# EAGLE board SCIENTECH_2201 (EAGLE 9.6.1), part 1 of 2
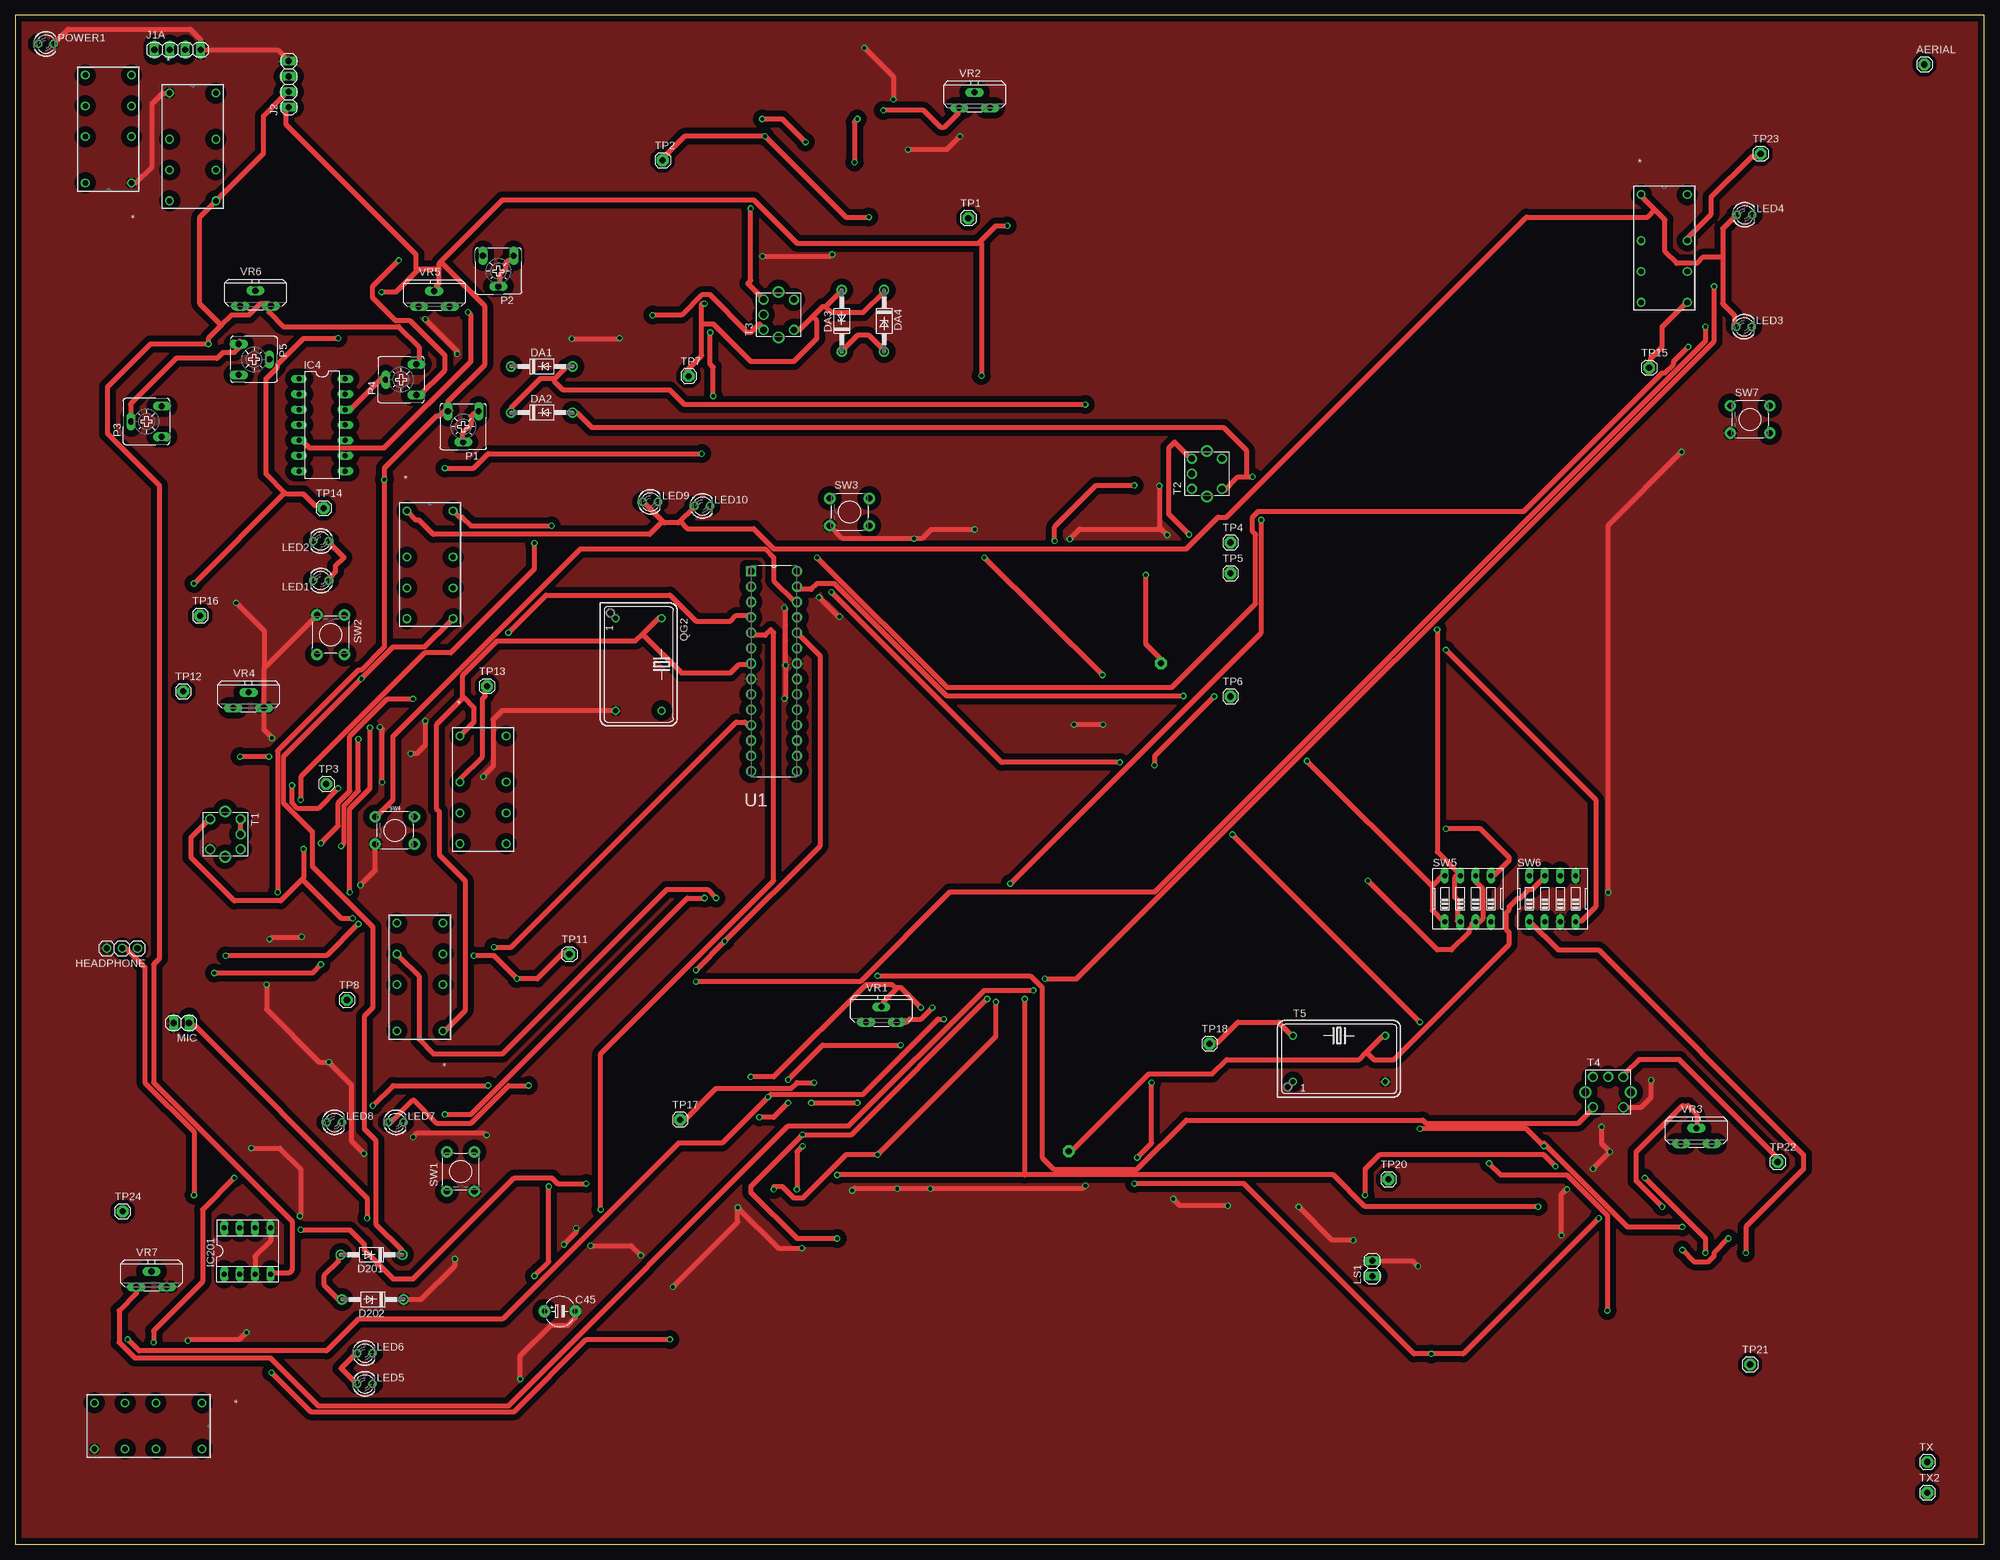
[diagram p2: board, top side]
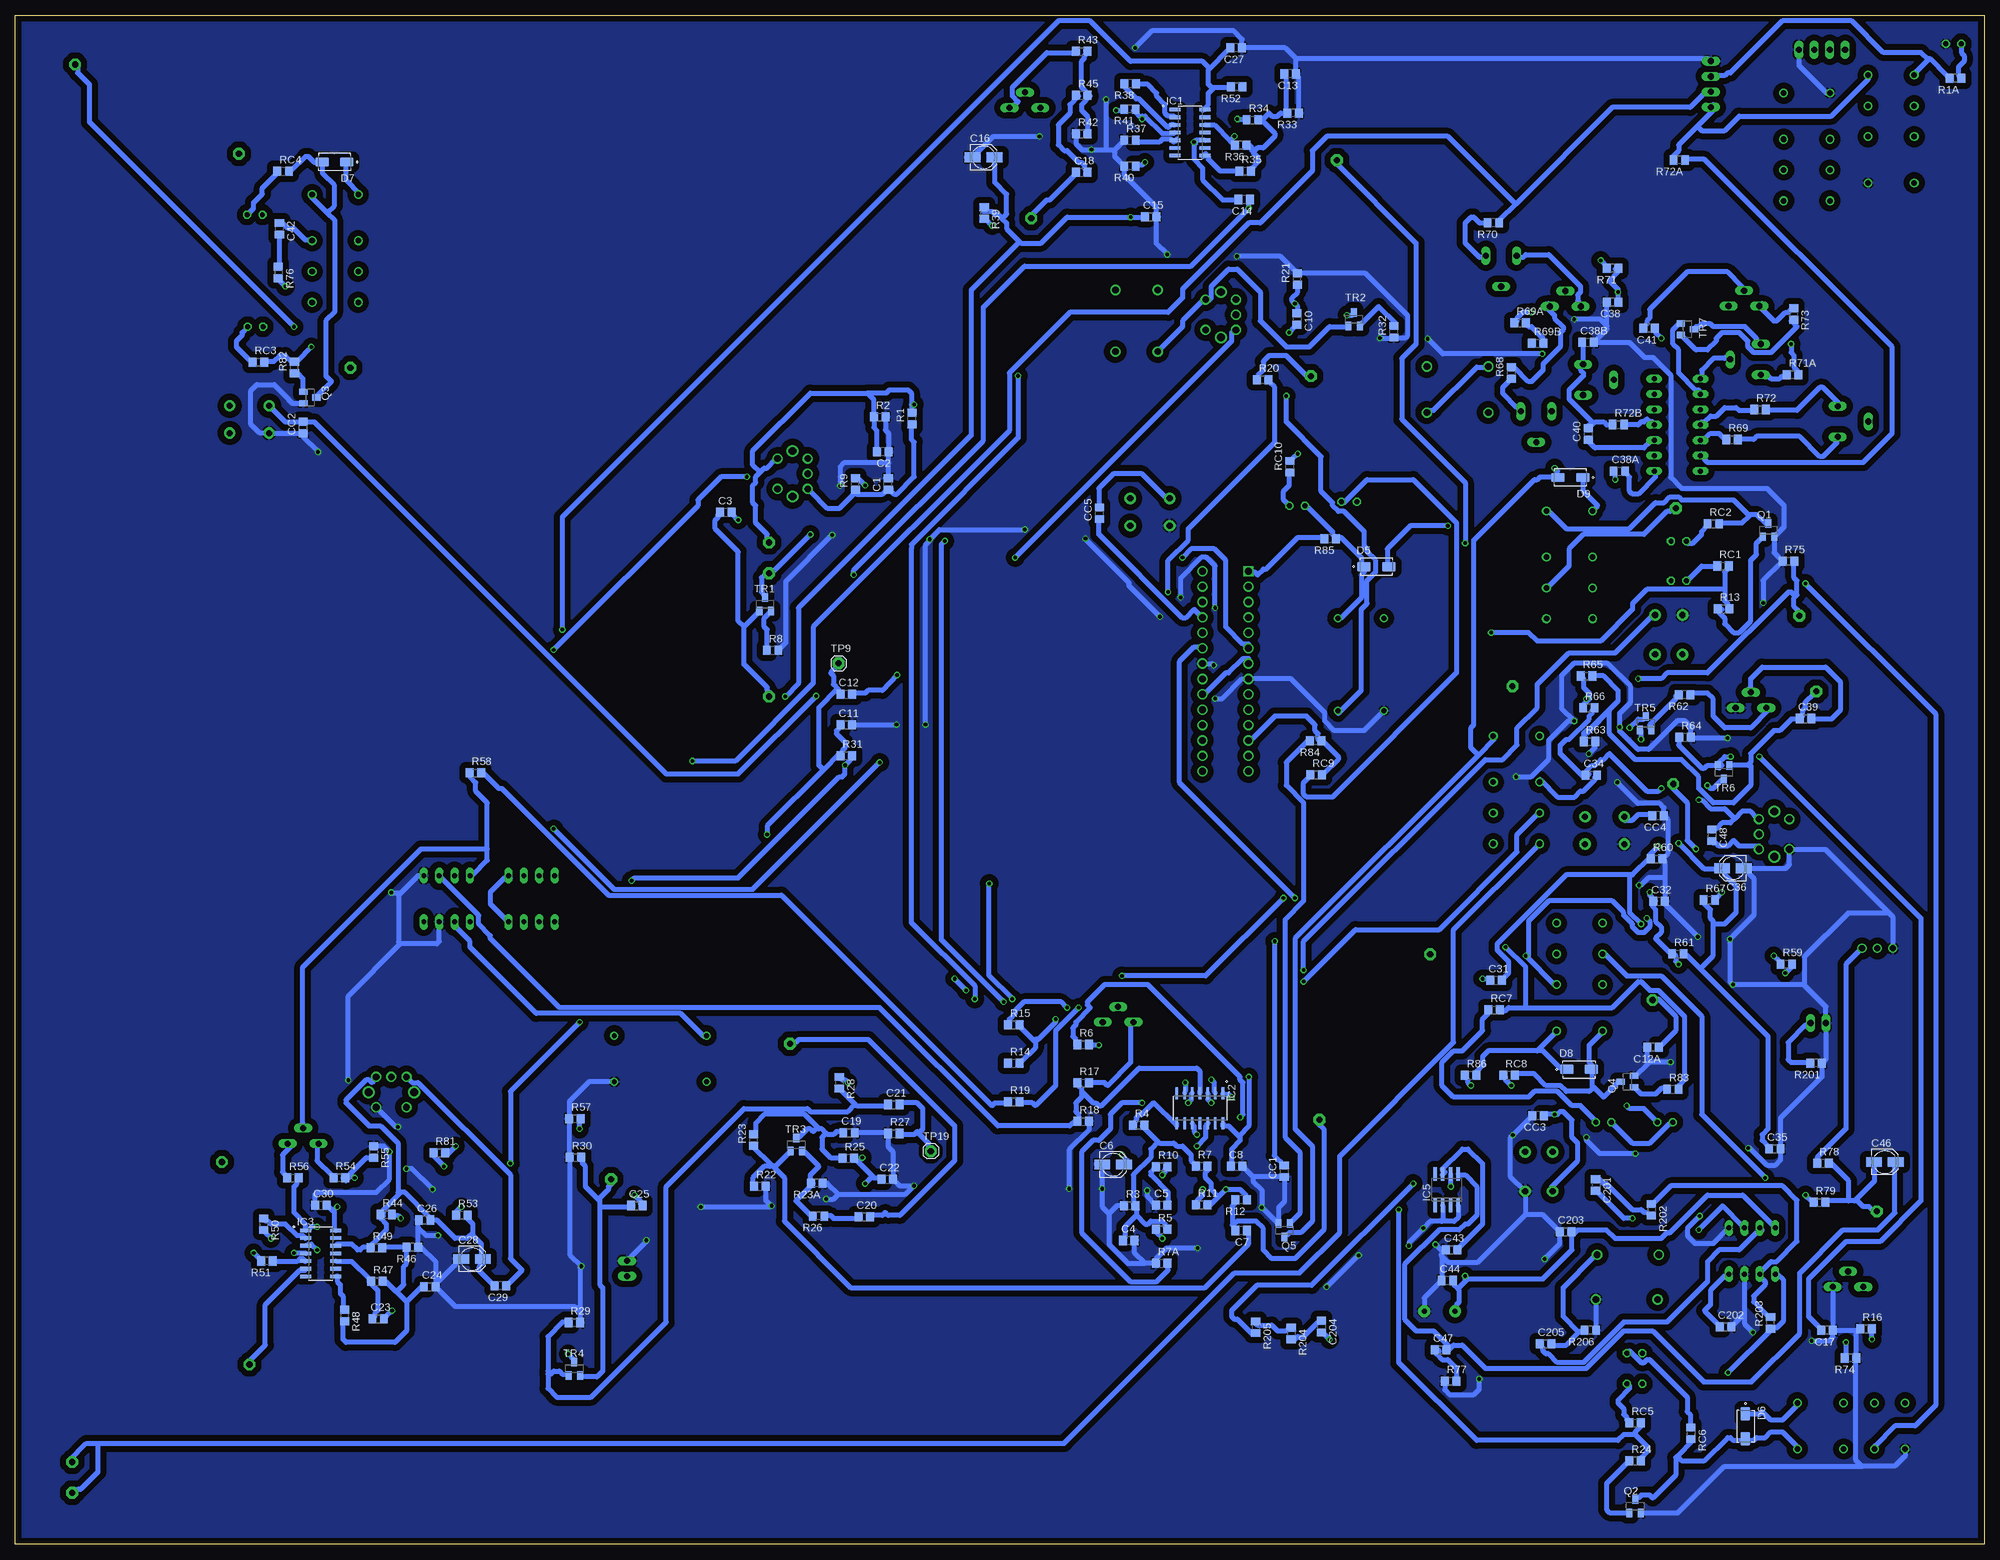
[diagram p3: board, bottom side, seen from below]

Size 325.1 x 252.4 mm. Coordinates in mm from the lower left corner, seen from the top.
Outline: 0,0 325.1,0 325.1,252.4 0,252.4 0,0
Copper layers (1*16): Top 0.035mm / dielectric 1.5mm / Bottom 0.035mm
Design rules "default *": minimum track width 0.8mm, minimum drill 0.6mm, track to track 6mil, track to pad 6mil, pad to pad 6mil, via to via 6mil, smd to smd 6mil, copper to edge 4mil, drill to drill 6mil, minimum pad ring 10mil, minimum via ring 8mil, stop-mask expansion 4mil, vias tented up to drill 0mil, thermal gap 10mil

## Footprints (pad centres in the part's own frame; a part is rotated, then mirrored left to right if it is on the bottom)
1X01 = drill 1.016 pad 1.93 octagon: 1 0,0
C0805 = smd 1.3 x 1.5: 1 -0.95,0; 2 0.95,0
153CLV-0405 = smd 2.6 x 1.6: + 1.8,0; - -1.8,0
E5-5 = drill 0.813 pad 1.905: + -2.54,0 | drill 0.813 pad 1.905 octagon: - 2.54,0
DIOM505270X240 = smd 2.21 x 1.53: A 2.05,0; C -2.05,0
DO41Z10 = drill 1.118: A 5.08,0; C -5.08,0
1X03 = drill 1.016: 1 -2.54,0; 2 0,0; 3 2.54,0
SOIC127P600X175-14N = smd 1.95 x 0.59: 1 -2.48,3.81; 2 -2.48,2.54; 3 -2.48,1.27; 4 -2.48,0; 5 -2.48,-1.27; 6 -2.48,-2.54; 7 -2.48,-3.81; 8 2.48,-3.81; 9 2.48,-2.54; 10 2.48,-1.27; 11 2.48,0; 12 2.48,1.27; 13 2.48,2.54; 14 2.48,3.81
DIL14 = drill 0.813 long: 1 -7.62,-3.81; 2 -5.08,-3.81; 3 -2.54,-3.81; 4 0,-3.81; 5 2.54,-3.81; 6 5.08,-3.81; 7 7.62,-3.81; 8 7.62,3.81; 9 5.08,3.81; 10 2.54,3.81; 11 0,3.81; 12 -2.54,3.81; 13 -5.08,3.81; 14 -7.62,3.81
SO08 = smd 0.6 x 2.2: 1 -1.905,-2.6; 2 -0.635,-2.6; 3 0.635,-2.6; 4 1.905,-2.6; 5 1.905,2.6; 6 0.635,2.6; 7 -0.635,2.6; 8 -1.905,2.6
SOCKET-08 = drill 0.813 long: 1 -3.81,-3.81; 2 -1.27,-3.81; 3 1.27,-3.81; 4 3.81,-3.81; 5 3.81,3.81; 6 1.27,3.81; 7 -1.27,3.81; 8 -3.81,3.81
1X04 = drill 1.016 long: 1 -3.81,0; 2 -1.27,0; 3 1.27,0; 4 3.81,0
LED3MM = drill 0.813 octagon: A -1.27,0; K 1.27,0
1X02 = drill 1.016 long: 1 -1.27,0; 2 1.27,0
CA6V = drill 1.016 long: A -2.54,-2.54; E 2.54,-2.54; S 0,2.54
SOT23 = smd 1 x 1.4: 1 -0.95,-1.1; 2 0.95,-1.1; 3 0,1.1
DIL14S = drill 0.813: 1 -7.62,-3.81; 7 7.62,-3.81; 8 7.62,3.81; 14 -7.62,3.81
R0805 = smd 1.3 x 1.5: 1 -0.95,0; 2 0.95,0
RELAY_HFD27_HNG = drill 0.914 pad 1.422: 1 0,0; 2 0,-7.62; 3 0,-12.7; 4 0,-17.78; 5 7.62,-17.78; 6 7.62,-12.7; 7 7.62,-7.62; 8 7.62,0
TACTILE-PTH = drill 1.016 pad 1.88: 1 -3.251,2.261; 2 3.251,2.261; 3 -3.251,-2.261; 4 3.251,-2.261
TACTILE_SWITCH_PTH_6.0MM = drill 1.016 pad 1.88: 1 -3.251,2.261; 2 3.251,2.261; 3 -3.251,-2.261; 4 3.251,-2.261
EDG-04 = drill 0.813 long: 1 -3.81,-3.81; 2 -1.27,-3.81; 3 1.27,-3.81; 4 3.81,-3.81; 5 3.81,3.81; 6 1.27,3.81; 7 -1.27,3.81; 8 -3.81,3.81
71-5 = drill 1.1: 1 2.5,-2.5; 2 2.5,2.5; 3 0,2.5; 4 -2.5,2.5; 5 -2.5,-2.5 | drill 1.3: S1 -3.75,0; S2 3.75,0
DIP254P762X457-28 = drill 1.118 square: 1 -7.62,33.02 | drill 1.118: 2 -7.62,30.48; 3 -7.62,27.94; 4 -7.62,25.4; 5 -7.62,22.86; 6 -7.62,20.32; 7 -7.62,17.78; 8 -7.62,15.24; 9 -7.62,12.7; 10 -7.62,10.16; 11 -7.62,7.62; 12 -7.62,5.08; 13 -7.62,2.54; 14 -7.62,0; 15 0,0; 16 0,2.54; 17 0,5.08; 18 0,7.62; 19 0,10.16; 20 0,12.7; 21 0,15.24; 22 0,17.78; 23 0,20.32; 24 0,22.86; 25 0,25.4; 26 0,27.94; 27 0,30.48; 28 0,33.02
PT-10S = drill 1.016 long: A -2.54,-1.27; E 2.54,-1.27; S 0,1.27

## Placement (x,y rotation side)
AERIAL  [1X01]  315.2,244.25 0 top
C1  [C0805]  180.96,175.04 90 bottom
C2  [C0805]  181.84,180.36 180 bottom
C3  [C0805]  207.76,170.33 0 bottom
C4  [C0805]  141.23,50.16 0 bottom
C5  [C0805]  135.79,56 0 bottom
C6  [153CLV-0405]  143.85,62.7 0 bottom
C7  [C0805]  122.67,51.8 180 bottom
C8  [C0805]  123.43,62.41 0 bottom
C10  [C0805]  113.48,202.26 270 bottom
C11  [C0805]  187.89,135.26 0 bottom
C12  [C0805]  187.89,140.34 0 bottom
C12A  [C0805]  54.67,82.03 180 bottom
C13  [C0805]  114.61,242.69 180 bottom
C14  [C0805]  122.21,221.97 180 bottom
C15  [C0805]  137.63,219.14 0 bottom
C16  [153CLV-0405]  165.23,228.96 0 bottom
C17  [C0805]  26,35.33 180 bottom
C18  [C0805]  148.99,226.47 0 bottom
C19  [C0805]  187.44,67.97 0 bottom
C20  [C0805]  184.94,54.07 0 bottom
C21  [C0805]  180.04,72.6 0 bottom
C22  [C0805]  181.14,60.28 0 bottom
C23  [C0805]  265.17,37.24 0 bottom
C24  [C0805]  256.66,42.55 0 bottom
C25  [C0805]  222.49,55.93 0 bottom
C26  [C0805]  257.49,53.54 0 bottom
C27  [C0805]  123.51,247 180 bottom
C28  [153CLV-0405]  249.69,47.12 0 bottom
C29  [C0805]  245.01,42.67 180 bottom
C30  [C0805]  274.63,55.98 0 bottom
C31  [C0805]  80.6,93.09 0 bottom
C32  [C0805]  53.7,106.13 0 bottom
C34  [C0805]  64.89,126.97 0 bottom
C35  [C0805]  34.6,65.3 0 bottom
C36  [153CLV-0405]  41.51,111.59 180 bottom
C38  [C0805]  61.36,205.04 180 bottom
C38A  [C0805]  60.26,177.15 0 bottom
C38B  [C0805]  65.45,198.39 0 bottom
C39  [C0805]  29.49,136.31 0 bottom
C40  [C0805]  65.38,183.27 90 bottom
C41  [C0805]  55.34,200.7 180 bottom
C42  [C0805]  281.47,217.15 270 bottom
C43  [C0805]  87.94,48.64 0 bottom
C44  [C0805]  88.64,43.56 0 bottom
C45  1000uf  [E5-5]  89.93,38.48 0 top
C46  [153CLV-0405]  16.43,63.12 0 bottom
C47  [C0805]  89.74,32.13 0 bottom
C48  [C0805]  45.01,117.04 270 bottom
C201  [C0805]  64.18,59.33 270 bottom
C202  [C0805]  42.73,35.93 0 bottom
C203  [C0805]  69.15,51.62 0 bottom
C204  [C0805]  109.46,35.93 270 bottom
C205  [C0805]  72.45,33.1 0 bottom
CC1  [C0805]  115.59,61.59 90 bottom
CC2  [C0805]  277.55,184.35 90 bottom
CC3  [C0805]  73.67,70.77 180 bottom
CC4  [C0805]  53.84,120.28 180 bottom
CC5  [C0805]  146.07,170.18 90 bottom
D5  M7  [DIOM505270X240]  100.38,161.38 0 bottom
D6  M7  [DIOM505270X240]  39.45,19.51 270 bottom
D7  M7  [DIOM505270X240]  272.38,228.16 180 bottom
D8  M7  [DIOM505270X240]  66.9,78.39 0 bottom
D9  M7  [DIOM505270X240]  68.34,176.08 180 bottom
D201  1N4728  [DO41Z10]  58.84,47.81 180 top
D202  1N4728  [DO41Z10]  59.04,40.43 180 top
DA1  1N4728  [DO41Z10]  86.97,194.42 0 top
DA2  1N4728  [DO41Z10]  86.97,186.8 0 top
DA3  1N4728  [DO41Z10]  136.46,201.95 90 top
DA4  1N4728  [DO41Z10]  143.46,201.95 270 top
HEADPHONE  [1X03]  17.66,98.37 180 top
IC1  MC1496DG  [SOIC127P600X175-14N]  131.15,233.02 0 bottom
IC2  MC1496DG  [SOIC127P600X175-14N]  129.5,71.98 270 bottom
IC3  MC1496DG  [SOIC127P600X175-14N]  274.65,48.02 0 bottom
IC4  [DIL14]  50.68,184.76 270 top
IC5  LM386M-1  [SO08]  88.77,58.53 0 bottom
IC201  [SOCKET-08]  38.35,48.42 0 top
J1A  [1X04]  26.81,246.68 0 top
J2  [1X04]  45.17,241.01 90 top
LED1  [LED3MM]  50.45,159.07 180 top
LED2  [LED3MM]  50.45,165.59 180 top
LED3  [LED3MM]  285.44,200.99 0 top
LED4  [LED3MM]  285.54,219.47 0 top
LED5  [LED3MM]  57.75,26.5 0 top
LED6  [LED3MM]  57.75,31.58 0 top
LED7  [LED3MM]  62.88,69.66 0 top
LED8  [LED3MM]  52.72,69.66 0 top
LED9  [LED3MM]  104.87,172.07 0 top
LED10  [LED3MM]  113.47,171.4 0 top
LS1  [1X02]  224.06,45.54 90 top
MIC  [1X02]  27.43,86.05 180 top
P1  [CA6V]  73.98,184.47 180 top
P2  [CA6V]  79.77,210.16 180 top
P3  [CA6V]  21.68,185.33 90 top
P4  [CA6V]  63.71,192.24 90 top
P5  [CA6V]  39.43,195.58 270 top
POWER1  [LED3MM]  5.08,247.65 0 top
Q1  1F  [SOT23]  35.65,167.41 0 bottom
Q2  1F  [SOT23]  57.65,6.28 0 bottom
Q3  1F  [SOT23]  276.43,189.29 270 bottom
Q4  1F  [SOT23]  58.95,76.37 90 bottom
Q5  1F  [SOT23]  115.57,51.85 180 bottom
QG2  [DIL14S]  102.94,145.24 270 top
R1  40200  [R0805]  177.04,185.84 90 bottom
R1A  100  [R0805]  4.78,241.97 180 bottom
R2  22k  [R0805]  182.36,186.09 0 bottom
R3  1k  [R0805]  141.1,55.91 0 bottom
R4  220  [R0805]  139.62,69.2 0 bottom
R5  220  [R0805]  135.8,51.98 0 bottom
R6  330  [R0805]  148.77,82.51 0 bottom
R7  1k  [R0805]  129.23,62.42 0 bottom
R7A  12k  [R0805]  135.83,46.4 0 bottom
R8  110  [R0805]  200.06,147.57 0 bottom
R9  100  [R0805]  186.38,175.04 90 bottom
R10  100  [R0805]  135.79,62.35 0 bottom
R11  3920  [R0805]  129.23,56.07 0 bottom
R12  3920  [R0805]  122.67,56.88 180 bottom
R13  10k  [R0805]  43.05,154.43 0 bottom
R14  22k  [R0805]  160.23,79.41 0 bottom
R15  47k  [R0805]  160.23,85.76 0 bottom
R16  1k  [R0805]  19.53,35.59 0 bottom
R17  47k  [R0805]  148.77,76.16 0 bottom
R18  1k  [R0805]  148.77,69.81 0 bottom
R19  100  [R0805]  160.23,73.06 0 bottom
R20  68100  [R0805]  119.16,192.24 0 bottom
R21  2740  [R0805]  113.44,208.84 90 bottom
R22  100k  [R0805]  202.14,59.12 0 bottom
R23  100k  [R0805]  203.17,66.76 90 bottom
R23A  4k7  [R0805]  192.76,59.63 180 bottom
R24  1k  [R0805]  57.65,13.8 0 bottom
R25  100  [R0805]  187.54,63.72 0 bottom
R26  4k7  [R0805]  192.46,54.18 180 bottom
R27  18k  [R0805]  180.04,67.82 0 bottom
R28  100k  [R0805]  189.04,76.2 270 bottom
R29  18k  [R0805]  232.79,36.62 0 bottom
R30  1k  [R0805]  232.59,63.87 0 bottom
R31  100  [R0805]  187.89,130.18 0 bottom
R32  2740  [R0805]  97.48,200.14 90 bottom
R33  220  [R0805]  114.11,236.24 180 bottom
R34  220  [R0805]  120.83,235.11 0 bottom
R35  220  [R0805]  122.03,226.66 0 bottom
R36  1k  [R0805]  122.77,230.94 180 bottom
R37  12k  [R0805]  141.05,231.76 0 bottom
R38  110  [R0805]  141.01,241.08 180 bottom
R39  100  [R0805]  165.11,219.74 270 bottom
R40  1k  [R0805]  141.05,227.49 180 bottom
R41  47k  [R0805]  141.05,236.89 180 bottom
R42  1k  [R0805]  148.99,232.82 0 bottom
R43  47k  [R0805]  149.03,246.41 0 bottom
R44  1k  [R0805]  263.85,54.44 0 bottom
R45  22k  [R0805]  148.99,239.17 0 bottom
R46  1k  [R0805]  259.51,49.05 180 bottom
R47  220  [R0805]  265.37,43.4 0 bottom
R48  220  [R0805]  270.73,37.8 270 bottom
R49  1k  [R0805]  265.46,48.96 0 bottom
R50  330  [R0805]  284.08,52.84 270 bottom
R51  12k  [R0805]  283.55,46.77 180 bottom
R52  100  [R0805]  123.41,240.55 180 bottom
R53  1k  [R0805]  251.37,54.35 0 bottom
R54  47k  [R0805]  271.59,60.53 0 bottom
R55  1k  [R0805]  265.92,64.79 270 bottom
R56  47k  [R0805]  279.26,60.48 0 bottom
R57  1k  [R0805]  232.69,70.28 0 bottom
R58  100  [R0805]  249.13,127.33 0 bottom
R59  4k7  [R0805]  32.7,95.78 0 bottom
R60  4k7  [R0805]  54.1,113.13 0 bottom
R61  100  [R0805]  50.6,97.45 0 bottom
R62  100  [R0805]  49.5,140.24 180 bottom
R63  18k  [R0805]  65.19,132.52 0 bottom
R64  100  [R0805]  49.4,133.22 0 bottom
R65  100k  [R0805]  65.69,143.32 0 bottom
R66  100k  [R0805]  65.29,138.07 0 bottom
R67  100  [R0805]  45.4,106.35 0 bottom
R68  15  [R0805]  78.1,193.34 90 bottom
R69  8k2  [R0805]  41.64,182.36 0 bottom
R69A  8k2  [R0805]  76.64,201.61 0 bottom
R69B  8k2  [R0805]  73.74,198.26 0 bottom
R70  33200  [R0805]  81.06,218.12 180 bottom
R71  10k  [R0805]  61.36,210.62 180 bottom
R71A  10k  [R0805]  31.65,193.07 0 bottom
R72  8k2  [R0805]  37.05,187.31 0 bottom
R72A  15  [R0805]  50.36,228.49 180 bottom
R72B  15  [R0805]  60.43,184.83 0 bottom
R73  1k  [R0805]  31.49,203.06 270 bottom
R74  10k  [R0805]  22.07,30.76 180 bottom
R75  100k  [R0805]  32.35,162.29 0 bottom
R76  47k  [R0805]  281.65,209.95 270 bottom
R77  10  [R0805]  88.14,26.95 0 bottom
R78  100  [R0805]  26.63,62.9 0 bottom
R79  100  [R0805]  27.23,56.45 0 bottom
R81  100  [R0805]  255.09,64.63 0 bottom
R82  10k  [R0805]  278.99,194.24 90 bottom
R83  10k  [R0805]  51.43,75.13 0 bottom
R84  10k  [R0805]  110.37,132.63 180 bottom
R85  10k  [R0805]  108,165.98 180 bottom
R86  10  [R0805]  84.82,77.42 0 bottom
R201  681  [R0805]  27.77,79.43 180 bottom
R202  4k7  [R0805]  54.96,55.23 270 bottom
R203  475k  [R0805]  35.29,36.57 90 bottom
R204  4k7  [R0805]  114.44,34.83 270 bottom
R205  4k7  [R0805]  120.29,35.83 270 bottom
R206  10k  [R0805]  65.05,35.35 180 bottom
RC1  1k  [R0805]  43.15,161.48 0 bottom
RC2  1k  [R0805]  44.75,168.46 0 bottom
RC3  1k  [R0805]  284.96,195.14 0 bottom
RC4  1k  [R0805]  280.86,226.62 0 bottom
RC5  1k  [R0805]  57.65,20.05 0 bottom
RC6  1k  [R0805]  48.47,18.35 270 bottom
RC7  1k  [R0805]  80.92,88.22 0 bottom
RC8  1k  [R0805]  78.47,77.42 0 bottom
RC9  1k  [R0805]  110.33,127.02 0 bottom
RC10  1k  [R0805]  114.65,177.87 90 bottom
RL1  HFD27/012-H  [RELAY_HFD27_HNG]  19.2,224.72 180 top
RL2  HFD27/012-H  [RELAY_HFD27_HNG]  25.5,239.54 0 top
RL3  HFD27/012-H  [RELAY_HFD27_HNG]  64.68,170.56 0 top
RL4  HFD27/012-H  [RELAY_HFD27_HNG]  30.86,23.36 270 top
RL5  HFD27/012-H  [RELAY_HFD27_HNG]  268.44,222.79 0 top
RL6  HFD27/012-H  [RELAY_HFD27_HNG]  70.64,84.76 180 top
RL7  HFD27/012-H  [RELAY_HFD27_HNG]  73.44,133.42 0 top
SW1  [TACTILE-PTH]  73.55,61.54 90 top
SW2  [TACTILE-PTH]  52.11,150.14 270 top
SW3  [TACTILE-PTH]  137.75,170.39 0 top
SW4  MOMENTARY-SWITCH-SPST-PTH-6.0MM  [TACTILE_SWITCH_PTH_6.0MM]  62.69,117.84 0 top
SW5  [EDG-04]  239.84,106.55 0 top
SW6  [EDG-04]  253.81,106.55 0 top
SW7  [TACTILE-PTH]  286.42,185.67 0 top
T1  [71-5]  34.7,117.22 270 top
T2  [71-5]  196.74,176.71 90 top
T3  [71-5]  126.05,202.96 90 top
T4  [71-5]  263,74.65 0 top
T5  [DIL14S]  218.56,80.16 0 top
TP1  [1X01]  157.35,218.89 0 top
TP2  [1X01]  106.9,228.44 0 top
TP3  [1X01]  51.37,125.51 0 top
TP4  [1X01]  200.64,165.35 0 top
TP5  [1X01]  200.64,160.27 0 top
TP6  [1X01]  200.64,139.95 0 top
TP7  [1X01]  111.17,192.82 0 top
TP8  [1X01]  54.77,89.85 0 top
TP9  [1X01]  189.16,145.42 0 bottom
TP11  [1X01]  91.5,97.41 0 top
TP12  [1X01]  27.74,140.79 0 top
TP13  [1X01]  77.9,141.63 0 top
TP14  [1X01]  50.94,171.02 0 top
TP15  [1X01]  269.75,194.21 0 top
TP16  [1X01]  30.55,153.27 0 top
TP17  [1X01]  109.77,70.1 0 top
TP18  [1X01]  197.17,82.63 0 top
TP19  [1X01]  173.94,64.9 0 bottom
TP20  [1X01]  226.71,60.25 0 top
TP21  [1X01]  286.42,29.69 0 top
TP22  [1X01]  290.97,63.12 0 top
TP23  [1X01]  288.15,229.53 0 top
TP24  [1X01]  17.75,54.96 0 top
TR1  1AM  [SOT23]  201.29,155.19 0 bottom
TR2  1AM  [SOT23]  104.06,202.2 0 bottom
TR3  1AM  [SOT23]  196.14,65.99 0 bottom
TR4  1AM  [SOT23]  232.79,29 0 bottom
TR5  1AM  [SOT23]  55.9,135.54 0 bottom
TR6  1AM  [SOT23]  43.03,127.42 180 bottom
TR7  1AM  [SOT23]  49.01,200.56 270 bottom
TX  [1X01]  315.67,13.6 0 top
TX2  [1X01]  315.67,8.52 0 top
U1  ATMEGA168PA-PU  [DIP254P762X457-28]  129.1,127.6 0 top
VR1  [PT-10S]  143.01,87.45 0 top
VR2  [PT-10S]  158.39,238.38 0 top
VR3  [PT-10S]  277.55,67.42 0 top
VR4  [PT-10S]  38.54,139.35 0 top
VR5  [PT-10S]  69.18,205.59 0 top
VR6  [PT-10S]  39.68,205.66 0 top
VR7  [PT-10S]  22.51,43.78 0 top

## Tracks (layer width: path | path; a pad name or v marks a point on that pad's centre or on a via)
4_IC1  (via drill 0.6)
  Top 0.8: v138.57,228.12 138.57,234.78 v139.05,235.26
  Bottom 0.8: v138.57,228.12 139.05,227.64 140,227.64 R40.1 | R41.1 140.48,236.69 v139.05,235.26 139.05,235.74 138.57,235.74 135.72,232.88 133.81,232.88 IC1.4
5  (via drill 0.6)
  Top 0.8: v131.43,72.88 v139.05,72.88
  Bottom 0.8: v139.05,72.88 142.38,72.88 144.29,70.97 144.29,68.59 146.19,66.68 147.15,66.68 149.05,64.78 149.05,51.45 140.96,43.35 136.67,43.35 134.76,45.26 134.76,46.21 R7A.2 | v131.43,72.88 130.96,73.35 130.96,74.3 IC2.5
8
  Bottom 0.8: R4.1 140.48,69.54 140,70.02 140,70.49 139.53,70.97 139.05,70.97 137.15,72.88 133.34,69.07 IC2.8
8_IC1
  Bottom 0.8: R35.1 123.34,226.69 126.19,226.69 128.1,228.59 128.1,229.07 128.57,229.54 129.05,229.07 IC1.8
10  (via drill 0.6)
  Top 0.8: v135.72,50.49 129.05,50.49 121.43,58.11 121.43,59.07 v130,67.64 138.1,67.64 v160.48,90.02 | v205.72,169.07 205.72,150.5 v164.29,109.07
  Bottom 0.8: v135.72,50.49 136.67,51.45 136.67,51.92 R5.1 | v130,67.64 130.48,68.11 130.48,69.07 IC2.10 | v205.72,169.07 206.67,170.02 C3.2 | v164.29,109.07 164.29,93.83 v160.48,90.02
10_IC1  (via drill 0.6)
  Top 0.8: v123.34,235.26 126.67,235.26 v130.48,231.45
  Bottom 0.8: C14.2 123.34,221.93 125.72,221.93 129.05,225.26 129.05,227.16 130.48,228.59 130.48,230.97 130.24,231.21 v130.48,231.45 130.18,231.75 IC1.10 | v123.34,235.26 121.91,235.26 R34.1
12  (via drill 0.6)
  Top 0.8: v129.05,58.59 129.05,64.78 v130,65.73
  Bottom 0.8: v129.05,58.59 129.05,57.64 130,56.68 130,56.21 R11.1 | v130,65.73 128.57,67.16 128.57,69.07 128.1,69.54 IC2.12
12-IC3
  Top 0.8: T4.2 265.72,77.16 265.72,77.64 268.1,80.02 274.77,80.02 291.43,63.35 TP22.1
  Bottom 0.8: IC3.12 271.91,49.54 269.53,49.54 268.58,48.59 268.1,48.59 267.62,49.07 266.67,49.07 R49.1 266.2,49.07 266.2,49.54 263.81,51.92 263.81,52.87 264.77,53.83 264.29,54.3 264.77,54.78 R44.1 264.29,54.78 264.29,55.26 261.67,57.87 | C29.2 246.19,42.87 248.58,45.26 248.58,45.73 247.62,46.68 C28.+ 248.1,47.16 248.1,49.54 249.53,50.97 249.53,51.45 | 249.53,51.45 249.53,52.87 250.48,53.83 250.48,54.3 R53.2 | 249.53,51.45 250.48,50.49 252.47,50.49 255.51,53.54 C26.2 256.67,53.83 256.67,54.03 260.75,58.11 261.43,58.11 261.67,57.87 | 261.67,57.87 261.91,58.11 261.91,66.21 264.77,69.07 266.67,69.07 270.48,72.88 270.48,73.35 267.15,76.68 266.67,76.68 266.2,76.21 265.72,76.68 T4.2
201-7
  Bottom 0.8: C205.1 73.33,32.87 72.86,32.4 72.86,31.92 72.38,31.45 71.91,31.45 70.48,30.02 66.19,30.02 59.52,36.68 52.38,36.68 45.72,43.35 45.72,46.68 43.81,48.59 40.48,48.59 37.62,51.45 37.14,51.45 36.67,51.92 IC201.7
201-8  (via drill 0.6)
  Top 0.8: v88.1,59.07 88.1,46.68 v85.72,44.3
  Bottom 0.8: 86.91,42.16 86.67,41.92 86.67,40.02 87.14,39.54 87.14,38.59 C45.+ | 86.91,42.16 87.62,42.87 87.62,43.35 C44.2 | 68.1,50.97 68.1,48.59 72.86,43.83 85.24,43.83 85.48,43.59 | 68.1,50.97 68.1,51.45 C203.2 68.1,50.97 | 86.91,42.16 85.48,43.59 | v88.1,59.07 88.1,60.97 IC5.6 | v85.72,44.3 85.72,43.83 85.48,43.59 | 68.1,50.97 67.14,51.92 62.38,51.92 60.95,50.49 53.33,50.49 52.38,51.45 51.91,51.45 45.72,57.64 39.89,57.64 34.5,52.25 IC201.8
+5V
  Bottom 0.8: 9.29,245.02 11.43,242.88 RL1.5 | 9.29,245.02 9.05,245.26 6.19,242.4 R1A.2 | 9.29,245.02 10.48,246.21 16.67,246.21 21.91,251.45 33.33,251.45 41.91,242.88 42.38,242.88 42.86,242.4 44.76,242.4 J2.3
+12V  (via drill 0.6)
  Top 0.8: 166.67,60.97 217.62,60.97 222.86,55.73 v251.43,55.73 | 166.67,60.97 v135.72,60.97 | v43.33,107.64 43.33,130.97 56.67,144.31 57.14,144.31 60.95,148.11 v60.95,175.73 60.95,177.64 69.53,186.21 70,186.21 71.43,187.64 | 71.43,187.64 71.91,187.16 P1.E 71.43,187.64 | v163.81,217.64 161.91,217.64 159.29,215.02 | 159.29,215.02 159.05,214.78 129.05,214.78 121.91,221.93 80.48,221.93 70.24,211.69 | 70.24,211.69 70,211.45 70,210.5 | 70,210.5 70,208.12 69.53,207.64 70,207.16 69.53,206.69 VR5.S | v60.48,206.69 62.86,206.69 66.43,210.26 | 66.43,210.26 66.67,210.5 70,210.5 | J2.1 44.76,237.16 44.76,234.31 66.19,212.88 66.19,210.5 66.43,210.26 | 71.43,187.64 71.43,188.59 77.49,194.65 77.49,204.43 70.24,211.69 | v166.67,90.02 166.67,60.97 | v159.53,192.88 159.53,214.78 159.29,215.02
  Bottom 0.8: v135.72,60.97 135.24,61.45 135.24,61.92 R10.2 | v251.43,55.73 252.39,54.78 R53.1 | v43.33,107.64 44.29,106.69 R67.2 | v60.95,175.73 60.95,176.69 C38A.1 | 47.38,234.07 44.29,237.16 44.76,237.64 J2.1 | 47.38,234.07 50.48,230.97 50.48,230.02 51.43,229.07 51.43,228.59 R72A.2 | RL1.4 19.18,242.48 19.18,241.79 25.24,235.74 40.48,235.74 42.86,233.35 46.67,233.35 47.38,234.07 | C38.1 60.48,205.26 v60.48,206.69 60.48,207.16 61.91,208.59 60.48,210.02 60.95,210.5 60.48,210.97 R71.1 | v163.81,217.64 164.76,218.59 R39.2 | v166.67,90.02 166.67,92.18 177.17,102.68 177.17,164.38 177.15,164.36 177.15,165.02 159.53,182.63 v159.53,192.88
-12V  (via drill 0.6)
  Top 0.8: 34.05,201.21 35.72,202.88 38.57,202.88 40.48,204.78 40.95,204.78 | 34.05,201.21 31.91,199.07 v31.91,198.12 22.34,198.12 15.24,191.02 15.24,183.35 23.81,174.78 23.81,96.69 22.86,95.73 22.86,76.21 45.72,53.35 45.72,45.26 45.24,44.78 42.38,44.78 IC201.4 | 40.95,204.78 41.91,204.78 VR6.E 40.95,204.78 | 34.05,201.21 30.48,204.78 30.48,219.07 32.86,221.45 RL2.5 33.33,221.93 40.95,229.54 40.95,235.74 44.29,239.07 44.29,239.55 44.76,240.02 J2.2 | 40.95,204.78 41.91,203.83 41.91,203.35 44.29,200.97 63.34,200.97 66.67,197.64 66.67,194.78 P4.E | 233.96,108.74 233.96,104.63 235.72,102.88 SW5.1 | 233.96,108.74 235.72,110.49 SW5.8 | v213.28,129.29 233.9,108.68 233.96,108.74
  Bottom 0.8: 64.53,185.02 64.76,184.78 65.24,184.78 65.72,184.31 C40.2 | 64.53,185.02 64.29,185.26 62.86,185.26 62.38,184.78 61.43,184.78 R72B.1 | C38B.1 66.19,198.12 66.19,194.78 P4.E 66.67,194.31 66.67,193.83 66.19,193.35 66.19,192.88 68.57,190.5 68.57,189.07 64.53,185.02 | C202.1 43.81,36.21 46.19,38.59 45.24,39.54 45.24,41.92 42.86,44.3 42.38,43.83 41.91,44.3 IC201.4 | v31.91,198.12 31.91,196.69 31.43,196.21 31.43,194.31 30.95,193.83 30.95,193.35 R71A.2 | 77.38,221.21 61.43,237.16 48.57,237.16 46.19,239.55 45.24,239.55 J2.2 | 77.38,221.21 80,218.59 R70.1 | v213.28,129.29 206.19,129.29 193.34,142.15 193.34,151.45 160.96,183.83 160.96,193.35 150.96,203.35 134.76,203.35 132.38,205.73 132.38,207.16 121.43,218.12 119.53,218.12 110.95,226.69 110.95,230.02 108.57,232.4 88.57,232.4 77.38,221.21
C7
  Bottom 0.8: 200,62.4 199.53,62.4 197.15,64.78 TR3.1 | 200.24,62.64 203.34,65.73 R23.1 | 200.24,62.64 200,62.4 | 200,62.4 198.1,60.49 198.1,53.35 187.15,42.4 128.67,42.4 121.43,49.64 121.43,51.45 C7.1 | R22.1 203.34,59.54 203.34,60.49 201.43,62.4 200.48,62.4 200.24,62.64
D7
  Bottom 0.8: RC4.2 279.53,226.69 277.15,229.07 276.67,229.07 275.72,228.12 274.77,228.12 D7.A 274.29,228.12 274.29,226.21 272.39,224.31 272.39,220.97 273.58,219.78 | 273.58,219.78 276.2,222.4 RL5.8 | 273.58,219.78 272.39,218.59 272.39,203.35 273.81,201.93 273.81,192.88 272.86,191.93 275.24,189.54 Q3.3
GND  (via drill 0.6)
  Top 0.8: v179.6,135.3 v174.8,135.3 | v174.1,165.9 175.75,167.55 189.25,167.55 | QG2.7 80.42,137.62 78.9,136.1 78.9,128.4 77.3,126.8 v77.3,126.7 | v67.7,135.9 67.7,131.9 66.3,130.5 v65.3,130.5 | IC201.5 42.16,50.06 39.62,47.52 IC201.3 | v92.6,52.2 92.6,51.5 v90.6,49.5 | v127,139.6 127.2,139.8 v127.2,145.1 127.2,154.4 v127,154.6 | D202.C 67.03,40.43 72.6,46 v72.6,47.1 | v138.2,58.4 138.6,58.8 145.55,58.8 v145.65,58.7 v151.1,58.7 176.2,58.7 v176.7,59.2 | v129.9,48.9 126,48.9 v119.3,55.6 119.3,53.2 v108.6,42.5 | v200.2,55.9 192.3,55.9 v191.2,57 | LS1.2 230.69,46.81 v231.6,45.9 | v261.9,68.9 261.9,66.2 v263.3,64.8 v260.5,62 | v255.3,51 255.3,57.8 256.1,58.6 v256.2,58.6 | T4.1 268.45,72.15 270.1,73.8 v270.1,76.6 | v263,107.6 263,168.2 v275.1,180.3 | v156,232.4 153.8,230.2 v147.4,230.2 | v123.4,212.6 134.6,212.6 v134.9,212.9 | J2.4 43.31,246.68 J1A.4 30.62,248.38 28.9,250.1 8.8,250.1 POWER1.K | RL1.1 19.92,224.72 22.6,227.4 22.6,237.8 24.34,239.54 RL2.1 | v67.7,202.2 73,196.9 v73,196.5 | v91.9,199 99.7,199 v99.8,199.1 | v220.9,50.2 217.4,50.2 v211.9,55.7 | v95,49.3 101.7,49.3 v103.3,47.7 | v83.4,27.3 83.4,31.1 88.5,36.2 91.3,36.2 92.47,37.37 C45.- | v38.2,35 37,33.8 28.7,33.8 v28.5,33.6 | v39,65.4 43.7,65.4 47.1,62 47.1,54.3 v47,54.2 | v42,99.9 42.3,100.2 47.3,100.2 v47.3,100.3 | v57,108.8 59.44,111.24 SW4.3 | 41.08,144.62 VR4.E 41.08,134.42 v42.4,133.1 | 41.08,144.62 SW2.3 | v36.5,155.4 41.08,150.82 41.08,144.62 | v41.5,92.4 41.5,88.3 50.2,79.6 v51.8,79.6 55.5,75.9 55.5,66.6 v57.6,64.5 | v60.6,125.8 60.6,134.6 60.3,134.9 v60.2,134.9 | v158.4,167.5 151.2,167.5 149.7,166 v148.4,166 136.63,166 SW3.3
  Top 0.8: v136.1,153.1 135.9,153.1 v132.7,156.3 | v140.2,247 145,242.2 v145,238.5 | v65.7,67.2 66.4,67.9 77.4,67.9 77.8,67.5 v77.84,67.55
  Top 0.813: v188.9,174.7 188.9,167.9 189.25,167.55 v190.2,166.6
  Bottom 0.8: C11.2 179.64,135.26 v179.6,135.3 | v174.8,135.3 174.8,165 174.1,165.7 v174.1,165.9 172.5,167.5 v158.4,167.5 | v77.3,126.7 74.8,126.7 71.9,129.6 71.9,132.7 68.7,135.9 v67.7,135.9 69.8,138 69.8,143.4 67.8,145.4 62.2,145.4 58.4,141.6 58.4,139 60.2,137.2 v60.2,134.9 60.2,134.2 57.2,131.2 55.4,131.2 50.7,135.9 49.4,135.9 48.45,134.95 R64.2 48.33,133.1 v42.4,133.1 | v65.3,130.5 64.24,131.56 R63.2 | RL4.5 13.08,14.62 14.8,12.9 20.2,12.9 | 20.2,12.9 20.17,12.87 42.93,12.87 50.62,5.18 Q2.2 | 20.2,12.9 21.2,13.9 21.2,30.68 | 21.2,30.68 R74.1 | IC201.3 39.62,38.09 | 39.62,38.09 C202.2 | 75.81,54.39 SW1.3 78.3,60.78 78.3,67.09 v77.84,67.55 CC3.2 | 89.5,47.5 89.6,47.6 89.6,47.93 C43.1 89.74,48.64 v90.6,49.5 | 89.5,47.5 88.5,46.5 83.7,46.5 75.81,54.39 | 89.5,47.5 89.5,43.65 C44.1 92.47,40.68 C45.- | IC5.4 86.86,53.94 87.5,53.3 89.6,53.3 | 89.6,53.3 91.5,53.3 v92.6,52.2 95,49.8 v95,49.3 | IC5.2 89.41,53.5 89.6,53.3 | U1.22 127.48,145.38 v127.2,145.1 | v127,139.6 125.8,139.6 122.56,142.84 U1.8 114.44,142.84 108.9,137.3 108.9,135.9 107.3,134.3 102.3,134.3 102.3,134.45 QG2.7 | 21.2,30.68 21.2,34.87 R16.1 20.74,35.33 C17.1 | v72.6,47.1 70.1,49.6 C203.1 72.87,54.39 75.81,54.39 | D202.C 64.12,35.37 R206.1 | C8.2 120.71,60.64 | 120.71,60.64 CC1.1 115.59,56.51 116.52,55.58 Q5.2 119.17,55.6 v119.3,55.6 119.3,58.5 120.71,59.91 120.71,60.64 | 138.6,46.4 R7A.1 136.78,47.12 135,48.9 v129.9,48.9 | C4.2 140.28,48.08 138.6,46.4 | R3.1 143.19,55.91 144.5,54.6 | 144.5,54.6 144.5,49.5 141.4,46.4 138.6,46.4 | C6.- v145.65,58.7 145.65,55.75 144.5,54.6 | C5.1 138.2,57.46 v138.2,58.4 | R18.2 147.82,68.38 151.1,65.1 v151.1,58.7
  Bottom 0.8: C19.2 181.14,67.97 R27.1 180.99,65.59 180.19,64.79 C22.2 179.11,59.2 v176.7,59.2 178.1,57.8 189.2,57.8 | R23A.1 191.03,59.63 189.2,57.8 | R22.2 201.19,56.79 200.3,55.9 v200.2,55.9 200.4,55.7 v211.9,55.7 | v191.2,57 190,57 189.2,57.8 | 231.84,38.4 231.84,45.66 v231.6,45.9 233.54,47.84 R30.1 233.64,63.97 R57.1 233.64,73.06 230.35,76.35 T5.7 | 231.84,38.4 R29.2 | C28.- 255.71,42.9 C24.2 | C24.2 255.71,46.71 258.05,49.05 R46.1 258.56,52.3 | C24.2 252.46,39.3 232.74,39.3 231.84,38.4 | 258.56,52.3 258.56,53.42 C26.1 | T4.1 262.25,68.9 v261.9,68.9 | R55.1 264.24,65.74 v263.3,64.8 263.3,60.3 265.5,58.1 275.2,58.1 275.58,57.72 C30.1 | 258.56,52.3 257.26,51 v255.3,51 | v256.2,58.6 259.6,62 v260.5,62 | v270.1,76.6 270.1,90.5 261.5,99.1 | 261.5,99.1 255.5,99.1 255.08,99.52 SW6.3 | SW6.5 258.54,110.36 261.45,107.45 | 261.45,107.45 261.8,107.1 261.8,99.4 261.5,99.1 | 261.45,107.45 262.85,107.45 v263,107.6 | v275.1,180.3 277.55,182.75 CC2.1 SW7.3 284.71,183.41 286.2,184.9 286.2,190.4 285.2,191.4 282.3,191.4 280,189.1 280,189 279.34,188.34 Q3.2 | C16.- 163.59,232.4 v156,232.4 | 145,230.2 v147.4,230.2 149,230.2 149.94,231.14 R42.1 | 145,230.2 143.56,230.2 | 143.56,230.2 R37.1 | 143.56,230.2 143.56,229.05 R40.2 142,226 136.68,220.68 C15.2 136.68,214.68 v134.9,212.9 | v123.4,212.6 116.25,212.6 R21.2 102.19,209.79 95.2,202.8 95.2,199.5 95.51,199.19 R32.1 97.57,199.1 v99.8,199.1 | R33.1 113.16,242.19 C13.1 113.66,245.27 | 113.66,245.27 115.39,247 C27.1 122.56,248.46 123.9,249.8 137.4,249.8 v140.2,247 | 113.66,245.27 45.62,245.27 J2.4 | J1A.4 30.62,244.12 26.04,239.54 RL2.1 | 62.31,201.1 62.31,200.58 C38B.2 58.59,198.39 56.1,195.9 54.7,195.9 51.8,193 51.8,176.1 50,174.3 35.9,174.3 33.1,171.5 33.1,167.91 Q1.2 34.7,163.69 R75.1 36.5,159.09 v36.5,155.4
  Bottom 0.8: 62.31,201.1 C38.2 | 62.31,201.1 63.41,202.2 v67.7,202.2 | v73,196.5 89.4,196.5 v91.9,199 | LS1.2 220.7,50.17 220.7,50.2 v220.9,50.2 | v103.3,47.7 108.5,42.5 v108.6,42.5 | R77.1 89.09,25.49 88.3,24.7 84.3,24.7 83.4,25.6 v83.4,27.3 | VR7.E C17.1 | 39.62,38.09 39.62,36.42 v38.2,35 | v28.5,33.6 25.6,33.6 25,34.2 25,35.28 C17.1 | v39,65.4 38.7,65.4 35.8,62.5 34.6,62.5 33.65,63.45 C35.2 33.65,70.35 26.82,77.18 R201.1 26.16,80.09 MIC.2 26.16,88.76 29.7,92.3 | v47,54.2 49,52.2 49,50.9 47.8,49.7 44.69,49.7 IC201.5 | HEADPHONE.3 15.12,103.62 15.7,104.2 | 15.7,104.2 26.22,114.72 T1.1 32.2,112.2 32.81,111.59 C36.- 38.1,109.98 38.1,103.8 v42,99.9 42,92.9 v41.5,92.4 29.8,92.4 29.7,92.3 | 52.75,110 52.75,112.73 R60.2 52.2,114.08 52.2,119.59 CC4.1 52.89,121.59 53.6,122.3 57.2,122.3 60.6,125.7 v60.6,125.8 | 52.75,110 C32.2 52.75,105.75 v47.3,100.3 | 52.75,110 55.5,110 56.7,108.8 v57,108.8 | Q4.2 57.58,77.32 55.62,79.28 | 55.62,79.28 C12A.2 | v51.8,79.6 55.3,79.6 55.62,79.28 | 15.7,104.2 22.5,104.2 29.7,97 29.7,92.3 | v127,154.6 127,161.5 128.4,162.9 129.3,162.9 132.7,159.5 v132.7,156.3 | v136.1,153.1 141.2,158.2 141.2,158.7 148.4,165.9 v148.4,166 | v145,238.5 145,230.2 | v57.6,64.5 63.5,64.5 65.7,66.7 v65.7,67.2
  Bottom 0.813: C1.2 180.89,176.06 180.89,178.5 | 180.89,178.5 C2.1 180.89,183.39 181.41,183.91 R2.2 | 180.89,178.5 188.3,178.5 188.9,177.9 v188.9,174.7 | v190.2,166.6 197.9,158.9 197.9,148.78 R8.2
  pour Top (isolate 1.016): 0,252.4 325.1,252.4 325.1,0 1.27,0 0,1.27
  pour Bottom (isolate 1.016): 1.27,252.4 323.83,252.4 325.1,251.13 325.1,0 1.27,0
IC4-8
  Bottom 0.8: C38A.2 59.05,176.69 58.57,176.21 58.57,173.83 58.1,173.35 57.14,173.35 54.29,176.21 54.29,176.69 IC4.8
IO1
  Bottom 0.8: R85.2 109.05,166.21 113.34,166.21 118.57,160.97 119.05,160.97 120,160.02 120.48,160.5 121.43,160.5 U1.1
IO4  (via drill 0.6)
  Top 0.8: v81.43,150.5 87.62,156.69 108.1,156.69 112.38,152.4 118.1,152.4 119.05,153.35 121.43,153.35 U1.4
  Bottom 0.8: 42.86,157.64 42.86,160.5 41.91,161.45 RC1.2 | 42.86,157.64 42.86,155.73 42.38,155.26 42.38,154.78 R13.2 | v81.43,150.5 75.24,150.5 73.81,149.07 63.34,149.07 58.1,154.31 58.1,155.26 55.72,157.64 42.86,157.64
IO5  (via drill 0.6)
  Top 0.8: v96.67,55.26 96.67,80.97 125.24,109.54 125.24,150.5 124.76,150.97 123.81,150.02 121.91,150.02 U1.5
  Bottom 0.8: 57.62,18.11 55.72,16.21 55.72,15.25 56.67,14.3 56.67,13.83 R24.2 | 57.62,18.11 57.62,18.59 56.67,19.54 56.67,20.02 RC5.2 | v96.67,55.26 96.67,30.02 83.81,17.16 60.48,17.16 59.52,18.11 57.62,18.11
IO6  (via drill 0.6)
  Top 0.8: v276.2,197.64 273.81,195.26 273.81,194.78 272.39,193.35 271.91,193.35 249.05,170.5 205.24,170.5 204.29,169.54 204.29,167.16 204.77,166.69 204.77,155.26 190.96,141.45 153.81,141.45 v132.38,162.88
  Bottom 0.8: RC3.2 283.81,195.26 282.39,195.26 281.43,196.21 280.48,196.21 279.53,195.26 279.05,195.26 R82.2 278.58,195.26 v276.2,197.64 | v132.38,162.88 130.96,164.31 127.14,164.31 125.24,162.4 125.24,151.45 122.38,148.59 121.43,148.59 121.43,148.11 U1.6
IO11  (via drill 0.6)
  Top 0.8: v79.05,98.59 81.91,98.59 119.05,135.73 120.48,135.73 120.95,135.26 121.43,135.26 U1.11
  Bottom 0.8: 75.72,88.59 78.57,88.59 79.05,88.11 79.53,88.11 RC7.2 | 75.72,88.59 61.43,88.59 57.14,92.88 56.67,92.88 55.24,91.45 53.81,91.45 49.52,87.16 49.52,76.68 50.48,75.73 50.48,75.26 R83.2 | v79.05,98.59 75.72,95.26 75.72,88.59
IO12
  Bottom 0.8: RC9.2 109.05,127.16 106.67,129.54 106.67,130.02 109.05,132.4 R84.1 109.53,132.4 110,132.88 110,133.83 110.48,134.3 110.48,135.26 111.91,136.69 117.14,136.69 120.95,132.88 121.43,132.88 U1.12
IO23  (via drill 0.6)
  Top 0.8: v113.81,106.69 110.95,106.69 75.24,70.97 v70.95,70.97
  Bottom 0.8: CC3.1 72.38,70.97 v70.95,70.97 70.48,70.97 70,71.45 69.53,71.45 68.1,70.02 68.1,67.16 67.14,66.21 67.14,63.35 71.43,59.07 71.43,58.59 SW1.1 | v113.81,106.69 132.86,125.73 132.86,145.73 130.48,148.11 129.53,148.11 U1.23
IO24  (via drill 0.6)
  Top 0.8: U1.24 129.53,150.02 132.86,146.69 132.86,115.26 v117.14,99.54 v112.38,94.78
  Bottom 0.8: v117.14,99.54 117.22,99.47 117.22,64.17 CC1.2 | v112.38,94.78 112.38,99.54 82.38,129.54 79.53,129.54 77.14,131.92 77.14,134.78 73.81,138.11 73.81,141.92 68.57,147.16 60.95,147.16 54.76,153.35 SW2.1
IO25
  Bottom 0.8: CC5.1 146.19,169.07 146.19,166.69 132.38,152.88 131.91,152.88 130.48,154.31 129.53,153.35 U1.25
IO26
  Top 0.8: U1.26 129.05,155.73 128.57,155.73 125.24,159.07 125.24,162.88 123.81,164.31 93.33,164.31 62.38,133.35 62.38,122.88 60,120.5 60,120.02 59.52,120.02 SW4.1
  Bottom 0.8: CC4.2 55.24,120.5 57.14,120.5 58.1,119.54 59.52,119.54 59.52,120.02 SW4.1
IO27  (via drill 0.6)
  Top 0.8: v192.86,140.02 153.81,140.02 135.24,158.59 132.38,158.59 131.43,157.64 129.53,157.64 U1.27
  Bottom 0.8: SW7.1 282.86,187.64 280.48,185.26 277.62,185.26 CC2.2 277.15,185.26 275.72,185.26 217.62,127.16 205.72,127.16 v192.86,140.02
N$2  (via drill 0.6)
  Top 0.8: v84.76,75.73 81.43,75.73 75.24,69.54 69.53,69.54 65.72,73.35 61.91,69.54 LED7.A
  Bottom 0.8: v84.76,75.73 85.24,76.21 85.24,76.68 85.72,77.16 R86.1 | LED8.A 51.91,69.54 55.24,66.21 58.1,66.21 61.43,69.54 LED7.A
N$3
  Bottom 0.8: RC7.1 81.91,88.11 81.91,87.64 82.86,86.68 82.86,84.78 86.19,81.45 87.62,81.45 89.53,79.54 89.53,75.73 87.62,73.83 75.24,73.83 74.29,74.78 70.48,74.78 68.1,72.4 66.67,72.4 64.29,70.02 LED7.K
N$4  (via drill 0.6)
  Top 0.8: v78.1,75.73 62.38,75.73 v59.05,72.4
  Bottom 0.8: v78.1,75.73 79.05,76.68 79.05,77.16 RC8.1 | v59.05,72.4 58.57,71.92 56.19,71.92 54.29,70.02 LED8.K
N$5
  Bottom 0.8: 64.53,75.49 64.76,75.73 64.76,78.11 | 64.53,75.49 62.86,73.83 60.48,76.21 Q4.3 | 64.53,75.49 65.24,74.78 69.05,74.78 70,75.73 72.38,75.73 74.29,77.64 77.14,77.64 RC8.2 | 64.76,78.11 64.29,78.59 65.24,79.54 65.24,82.4 63.34,84.3 RL6.8 | 64.76,78.11 D8.A
N$6
  Bottom 0.8: C48.2 44.76,115.73 44.29,115.73 43.81,115.26 42.38,115.26 41.43,116.21 40.48,115.26 37.14,115.26 37.14,114.78 T1.2
N$7  (via drill 0.6)
  Top 0.8: v113.34,180.02 78.1,180.02 75.72,177.64 v70.95,177.64
  Bottom 0.8: v113.34,180.02 114.29,179.07 RC10.2 | v70.95,177.64 70.48,177.16 70.48,176.21 | 83.57,130.26 80.95,132.88 80.95,133.35 RL7.8 | 83.57,130.26 113.81,100.02 113.81,68.59 110.95,65.73 110.95,53.35 112.86,51.45 114.76,51.45 115.24,50.97 Q5.3 | 70.48,176.21 73.33,176.21 73.81,175.73 74.29,175.73 84.29,165.73 84.29,135.26 84.76,134.78 84.76,131.45 83.57,130.26 | 70.48,176.21 D9.A
N$8  (via drill 0.6)
  Top 0.8: v56.67,132.88 56.67,124.3 54.29,121.92 54.29,115.73 v53.81,115.26 | v34.76,97.16 51.43,97.16 v56.67,102.4
  Bottom 0.8: v56.67,132.88 56.67,134.3 TR5.1 | v53.81,115.26 55.24,113.83 55.24,113.35 | 58.57,110.49 58.1,110.49 55.24,113.35 | 58.57,110.49 69.05,110.49 80.48,99.07 80.48,98.11 78.57,96.21 78.57,94.3 79.53,93.35 C31.2 | 55.24,113.35 R60.1 | v34.76,97.16 33.81,96.21 R59.1 | v56.67,102.4 58.57,104.3 58.57,110.49
N$9  (via drill 0.6)
  Top 0.8: v32.86,94.3 49.05,94.3 v50.48,95.73 | v58.57,134.78 58.57,124.78 55.24,121.45 v55.24,107.64
  Bottom 0.8: v32.86,94.3 31.91,95.26 31.91,95.73 R59.2 | v50.48,95.73 50.95,96.21 50.95,97.16 51.43,97.64 R61.1 51.91,97.64 54.29,100.02 53.33,100.97 53.33,101.92 54.29,102.88 54.29,104.78 54.76,105.26 54.76,105.73 C32.1 54.29,106.21 55.24,107.16 v55.24,107.64 | v58.57,134.78 57.14,136.21 56.19,136.21 TR5.3
N$11
  Bottom 0.8: C5.2 134.76,56.21 134.76,58.11 137.62,60.97 137.62,61.45 137.15,61.92 R10.1
N$12
  Bottom 0.8: 65.24,134.3 65.72,134.3 66.19,133.83 | R65.2 64.29,143.35 62.86,143.35 60.48,140.97 60.48,139.17 66.19,133.45 | R63.1 66.19,132.88 66.19,133.45 | 38.81,128.83 38.57,129.07 38.57,130.5 34.76,134.3 33.81,134.3 31.91,136.21 30.48,136.21 C39.1 30,136.69 30,137.64 29.52,138.11 29.52,139.07 28.1,140.5 TP12.1 | 38.81,128.83 39.05,128.59 41.91,128.59 TR6.1 | 38.81,128.83 38.57,128.59 38.57,125.26 41.43,122.4 44.76,122.4 47.14,124.78 47.14,126.69 50,129.54 57.62,129.54 61.88,133.8 61.88,137.67 65.24,134.3 | 65.24,134.3 65.72,133.83 66.19,133.83 | 66.19,133.83 66.19,133.45
N$13
  Bottom 0.8: 311.44,16.68 313.34,16.68 316.2,13.83 315.72,13.35 TX.1 | 311.44,16.68 151.91,16.68 123.78,44.81 113.04,44.81 106.4,51.45 106.4,64.1 87.62,82.88 87.62,101.45 73.81,115.26 RL7.4 | 311.44,16.68 311.44,11.92 314.29,9.06 314.77,9.06 315.24,8.59 TX2.1
N$14
  Top 0.8: TP13.1 77.62,141.45 77.62,140.02 77.14,139.54 77.14,130.02 73.33,126.21 RL7.2
  Bottom 0.8: C34.2 64.29,126.69 64.29,126.21 66.19,124.3 66.67,124.3 67.62,123.35 70.48,123.35 73.33,126.21 RL7.2
N$15
  Bottom 0.8: RC9.1 111.43,126.69 112.38,125.73 112.38,123.83 111.91,123.35 107.62,123.35 87.14,143.83 87.14,168.59 94.29,175.73 101.91,175.73 105.72,171.92 LED9.K
N$16
  Bottom 0.8: RC10.1 114.76,176.69 114.76,174.78 115.72,173.83 115.72,172.4 114.76,171.45 LED10.K
N$17
  Bottom 0.8: Q5.1 114.29,53.35 113.01,54.63 113.01,64.76 115.46,67.21 115.46,103.13 112.38,106.21 112.38,122.4 115.24,125.26 115.24,129.07 111.43,132.88 R84.2
N$18  (via drill 0.6)
  Top 0.8: v112.38,92.88 139.53,92.88 154.29,107.64 188.1,107.64 279.05,198.59 v279.05,200.97
  Bottom 0.8: v112.38,92.88 103.81,101.45 90,101.45 77.14,114.3 77.14,117.16 73.81,120.5 RL7.3 | v279.05,200.97 312.86,234.78 312.86,240.97 314.77,242.88 314.77,243.83 AERIAL.1
N$19
  Bottom 0.8: CC5.2 146.19,171.45 146.19,174.31 143.81,176.69 139.05,176.69 134.76,172.4 SW3.1
N$20
  Bottom 0.8: Q4.1 57.62,75.26 56.67,74.3 54.29,74.3 53.33,75.26 52.38,75.26 R83.1
N$21  (via drill 0.6)
  Top 0.8: v122.86,70.49 125.24,70.49 v127.62,72.88
  Bottom 0.8: v122.86,70.49 122.38,70.97 122.38,76.21 122.86,76.68 122.86,77.16 138.1,92.4 145.24,92.4 148.1,89.54 148.1,89.06 147.62,88.59 150,86.21 150,85.73 150.48,85.26 150.48,83.83 150,83.35 150,82.88 R6.1 | v127.62,72.88 128.2,73.45 128.2,74.42 IC2.3
N$22  (via drill 0.6)
  Top 0.8: v146.19,82.4 133.34,82.4 v127.62,76.68
  Bottom 0.8: v146.19,82.4 147.62,82.4 R6.2 | v127.62,76.68 127.14,76.21 127.14,74.78 IC2.2
N$23
  Bottom 0.8: R17.2 147.62,76.21 145.24,76.21 144.76,75.73 140.96,79.54 140.96,86.21 140.48,86.21 VR1.A
N$24  (via drill 0.6)
  Top 0.8: v151.43,88.59 149.53,86.68 147.62,86.68 147.15,86.21 145.72,86.21 VR1.E
  Bottom 0.8: v151.43,88.59 152.38,89.54 158.57,89.54 160,88.11 160,87.64 160.96,86.68 160.96,86.21 R15.1
N$26
  Bottom 0.8: 186.43,72.64 188.57,74.78 R28.2 | 186.43,72.64 186.19,72.4 181.43,72.4 C21.1 | 236.91,28.35 237.15,28.59 237.15,34.3 234.77,36.68 233.81,36.68 R29.1 | 236.91,28.35 236.67,28.11 236.19,28.59 235.24,28.59 234.77,28.11 233.81,28.11 TR4.1 | 186.43,72.64 187.62,71.45 193.81,71.45 194.29,71.92 204.77,71.92 217.62,59.07 217.62,36.68 230,24.3 235.72,24.3 237.15,25.73 237.15,28.11 236.91,28.35
N$27  (via drill 0.6)
  Top 0.8: v131.91,76.21 129.05,76.21 128.1,75.26 115.72,75.26 110,69.54 109.53,70.02 TP17.1
  Bottom 0.8: 124.05,52.64 124.16,52.75 124.16,55.86 123.34,56.68 R12.2 | 124.05,52.64 123.81,52.4 123.81,51.92 C7.2 | v131.91,76.21 131.91,74.78 IC2.6 | 124.05,52.64 123.34,53.35 120.25,53.35 119.05,52.15 119.05,48.59 117.62,47.16 113.81,47.16 109.05,51.92 109.05,68.59 110,69.54 110,70.02 TP17.1
N$28
  Bottom 0.8: C29.1 243.81,42.87 241.43,45.26 243.34,47.16 243.34,60.97 258.58,76.21 259.53,76.21 260.48,77.16 T4.4
N$29
  Bottom 0.8: 140,54.3 138.57,52.87 138.1,52.87 137.62,53.35 135.72,53.35 135.24,52.87 135.24,52.4 R5.2 | 140,54.3 140,55.73 R3.2 140.48,56.21 140.48,60.97 137.62,63.83 137.62,65.26 136.43,66.45 | 140,54.3 141.91,52.4 141.91,50.49 C4.1 | 136.43,66.45 139.05,69.07 R4.2 | 136.43,66.45 136.19,66.21 133.81,66.21 133.34,65.73 132.38,65.73 130.96,64.3 130.96,63.35 130.48,62.87 R7.1
N$30
  Bottom 0.8: R50.1 283.81,53.35 283.34,53.35 282.86,52.87 280.48,52.87 278.58,50.97 277.62,50.97 277.15,50.49 IC3.2
N$31  (via drill 0.6)
  Top 0.8: v282.86,50.49 280.48,48.11 280.48,47.64 279.53,46.68 277.15,46.68 v275.24,48.59
  Bottom 0.8: v282.86,50.49 283.81,51.45 R50.2 | v275.24,48.59 276.2,49.54 276.67,49.54 IC3.3
N$32
  Bottom 0.8: IC3.6 277.15,45.26 278.1,45.26 283.81,39.54 283.81,32.87 286.67,30.02 TP21.1
N$33
  Bottom 0.8: R51.1 282.39,46.68 278.58,46.68 278.1,47.16 277.62,47.16 277.15,46.68 IC3.5
N$34
  Bottom 0.8: R48.1 270.96,39.06 270.96,40.97 271.43,41.45 271.43,42.87 271.91,43.35 271.91,44.3 IC3.8
N$35
  Bottom 0.8: C23.1 265.72,37.64 265.72,38.11 265.24,38.59 265.24,41.92 266.67,43.35 R47.1 266.67,43.83 269.53,46.68 271.91,46.68 IC3.10
N$36
  Bottom 0.8: 260.48,40.02 260.48,35.26 262.39,33.35 270.48,33.35 270.96,33.83 270.96,36.68 R48.2 | 260.48,40.02 257.62,42.87 C24.1 | 260.48,40.02 262.15,41.68 | R47.2 264.29,43.35 263.86,43.35 262.17,41.66 262.15,41.68 | 262.15,41.68 260.96,42.87 260.96,45.88 260.48,46.36 260.48,48.59 R46.2 260.48,49.07 264.29,49.07 R49.2
N$37  (via drill 0.6)
  Top 0.8: v105.24,202.88 110,202.88 113.34,206.21 114.76,206.21 120.95,200.02 121.43,200.02 122.86,201.45 123.81,200.5 T3.4 | v160,162.88 v179.52,143.5
  Bottom 0.8: v105.24,202.88 104.29,202.88 TR2.3 | v179.52,143.5 181.91,140.97 184.29,140.97 184.77,140.5 186.67,140.5 C12.2 | v160,162.88 124.29,198.59 124.29,200.02 123.81,200.5 T3.4
N$38
  Bottom 0.8: TR2.2 102.86,201.45 100,204.31 97.14,201.45 R32.2
N$39
  Top 0.8: DA3.C 136.67,197.16 139.05,199.54 140.96,199.54 143.34,197.16 DA4.A
  Bottom 0.8: TR2.1 105.24,200.97 108.1,200.97 111.43,197.64 115.24,197.64 119.53,201.93 119.53,206.69 123.34,210.5 124.76,210.5 127.62,207.64 127.62,205.73 128.1,205.26 T3.1 128.57,205.73 132.38,201.93 132.38,200.97 136.19,197.16 DA3.C
N$40  (via drill 0.6)
  Top 0.8: 131.67,202.64 133.34,204.31 133.81,204.31 | 131.67,202.64 129.53,200.5 128.57,200.5 T3.5 | 133.81,204.31 136.19,206.69 DA3.A | 133.81,204.31 134.76,203.35 140,203.35 143.34,206.69 DA4.C | v113.81,204.78 113.34,204.78 113.34,201.45 | 113.34,201.45 113.34,196.21 110.95,193.83 110.95,192.88 TP7.1 | 131.67,202.64 132.38,201.93 132.38,199.07 128.57,195.26 121.43,195.26 115.24,201.45 113.34,201.45
  Bottom 0.8: R21.1 113.34,207.64 113.34,206.69 114.29,205.73 114.29,205.26 v113.81,204.78 113.34,204.31 113.34,203.35 C10.1 | R20.1 120,192.4 120,192.88 119.05,193.83 119.05,195.26 118.1,196.21 115.24,196.21 111.43,192.4 TP7.1
N$41  (via drill 0.6)
  Top 0.8: v222.86,57.64 222.86,61.92 225.24,64.3 252.39,64.3 v254.29,62.4
  Bottom 0.8: v222.86,57.64 221.91,56.68 221.91,56.21 C25.2 | v254.29,62.4 256.2,64.3 R81.1
N$42
  Bottom 0.8: R54.1 272.86,60.97 275.24,63.35 275.24,65.73 VR3.A
N$43
  Bottom 0.8: R56.1 280.48,60.49 280.48,60.97 280.96,61.45 280.96,64.3 279.53,65.73 279.53,66.21 280.01,66.21 VR3.E
N$44
  Bottom 0.8: 228.58,56.68 228.58,57.16 227.15,58.59 227.15,59.07 226.19,60.02 226.67,60.49 TP20.1 | 228.58,56.68 228.58,55.73 | 228.58,55.73 228.58,42.87 228.1,42.4 228.1,28.59 229.05,27.64 231.43,27.64 TR4.2 | 228.58,55.73 223.81,55.73 C25.1 | 228.58,56.68 230.96,59.07 230.96,62.4 231.43,62.87 231.43,63.83 R30.2
N$45
  Bottom 0.8: R38.1 140,240.97 138.1,240.97 136.67,239.55 136.67,239.07 135.24,237.64 135.24,236.21 134.76,235.74 133.81,235.74 IC1.2
N$47
  Bottom 0.8: 192.38,68.59 191.91,68.59 191.19,67.88 | 192.38,68.59 192.86,68.59 193.34,68.11 193.81,68.59 194.29,68.59 195.72,67.16 TR3.3 | 191.19,67.88 190.96,67.64 190,67.64 189.53,68.11 188.57,68.11 C19.1 | 191.19,67.88 191.91,67.16 191.91,65.26 190.48,63.83 188.57,63.83 R25.1 | 192.38,68.59 194.77,70.97 201.43,70.97 202.86,69.54 202.86,68.11 R23.2
N$48
  Bottom 0.8: 120.72,229.78 120.95,230.02 120.95,230.5 121.43,230.97 R36.1 | 120.72,229.78 120,229.07 120,228.12 120.95,227.16 120.95,226.69 R35.2 | 119.29,235.02 119.53,234.78 R34.2 | 119.29,235.02 118.1,236.21 117.62,235.74 116.67,235.74 116.19,236.21 115.24,236.21 R33.2 115.24,236.69 115.24,242.4 C13.2 | 120.72,229.78 120,230.5 119.05,230.5 117.14,232.4 117.14,232.88 119.29,235.02
N$49
  Bottom 0.8: TR3.2 194.77,64.78 192.38,62.4 193.81,60.97 193.81,60.02 R23A.2 193.34,59.54 196.19,56.68 193.81,54.3 R26.2
N$50
  Bottom 0.8: C20.1 186.19,53.83 190,53.83 190.48,54.3 191.43,54.3 R26.1
N$51
  Bottom 0.8: R38.2 141.91,240.97 141.91,240.5 140,238.59 139.53,238.59 134.76,233.83 134.29,234.31 133.81,234.31 IC1.3
N$52
  Bottom 0.8: R42.2 148.1,232.88 148.1,235.74 149.05,236.69 149.05,237.64 147.62,239.07 R45.2 148.1,239.55 149.05,240.5 149.05,244.78 148.57,245.26 148.57,245.74 148.1,246.21 R43.2
N$53
  Bottom 0.8: C18.2 148.1,226.69 148.57,227.16 148.57,227.64 149.05,228.12 149.53,228.12 151.43,230.02 151.91,230.02 152.86,230.97 152.86,234.31 150.96,236.21 150.96,237.64 149.53,239.07 R45.1
N$54
  Bottom 0.8: R43.1 150,246.21 154.76,246.21 160.48,240.5 160.48,239.07 159.53,238.12 160.48,237.16 VR2.E
N$55
  Bottom 0.8: C18.1 150,226.21 154.29,221.93 154.76,221.93 157.62,219.07 TP1.1
N$56  (via drill 0.6)
  Top 0.8: v143.34,236.69 150,236.69 152.86,233.83 153.34,233.83 155.72,236.21 155.24,236.69 155.24,237.16 155.72,237.16 VR2.A
  Bottom 0.8: v143.34,236.69 142.38,236.69 R41.2
N$57
  Bottom 0.8: R37.2 140,231.45 136.19,231.45 135.72,231.93 134.29,231.93 133.81,231.45 133.34,231.93 IC1.5
N$58
  Bottom 0.8: C39.2 28.1,136.21 25.24,136.21 23.81,137.64 23.81,142.4 26.19,144.78 36.67,144.78 38.57,142.88 38.57,141.45 39.05,140.97 38.57,140.5 VR4.S
N$59
  Bottom 0.8: 186.43,173.59 186.67,173.83 R9.1 | 186.43,173.59 186.19,173.35 181.91,173.35 181.43,173.83 C1.1 180.96,174.31 180.48,174.31 180.48,173.83 180,173.35 179.53,173.35 176.67,176.21 176.67,181.92 177.15,182.4 177.15,184.78 R1.1 | 186.43,173.59 189.05,170.97 190.96,170.97 193.81,173.83 T2.4
N$60
  Bottom 0.8: TR1.2 200.48,153.83 201.43,152.88 201.43,151.45 200.96,150.97 200.96,147.64 R8.1
N$61
  Bottom 0.8: 204.77,151.45 202.38,153.83 TR1.1 | 204.77,151.45 204.77,145.26 200.96,141.45 200.96,140.97 200.48,140.5 200.48,140.02 TP6.1 | 204.77,151.45 205.72,152.4 205.72,163.83 209.53,167.64 209.53,169.07 209.05,169.54 209.05,170.02 C3.1
N$62
  Bottom 0.8: C12A.1 53.33,82.4 50.95,84.78 50.95,87.16 53.81,90.02 54.76,90.02 TP8.1
N$63
  Bottom 0.8: RC4.1 281.91,226.21 284.29,223.83 284.29,222.88 285.72,221.45 285.72,220.5 286.67,219.54 LED4.K
N$64
  Bottom 0.8: RC3.1 286.2,195.26 288.58,197.64 288.58,198.59 287.62,199.54 287.62,200.02 286.67,200.97 LED3.K
N$66
  Bottom 0.8: Q3.1 277.62,190.5 277.62,192.4 278.58,193.35 R82.1
N$67
  Top 0.8: RL5.5 275.72,204.78 271.91,200.97 271.91,197.64 270,195.73 270,195.26 269.53,194.78 269.53,194.31 TP15.1
N$68
  Top 0.8: TP23.1 288.1,229.07 286.67,229.07 280.01,222.4 280.01,219.54 275.72,215.26 RL5.7
  Bottom 0.8: C42.1 281.43,218.12 280.96,218.12 280.01,217.16 279.05,217.16 277.15,215.26 276.2,215.26 RL5.7
N$69
  Bottom 0.8: C42.2 281.43,215.74 281.43,210.97 R76.1
N$72  (via drill 0.6)
  Top 0.8: v88.57,168.12 75.24,168.12 73.81,169.54 73.33,169.54 72.38,170.5 RL3.8
  Bottom 0.8: 38.81,169.78 40,168.59 43.33,168.59 RC2.2 | 38.81,169.78 38.57,170.02 37.62,170.02 36.19,168.59 35.72,168.59 Q1.3 | v88.57,168.12 94.76,168.12 98.57,164.31 98.57,161.45 D5.A | 38.81,169.78 41.43,172.4 50,172.4 50.48,172.88 51.91,172.88 52.86,171.92 54.29,171.92 58.57,167.64 69.05,167.64 71.91,170.5 RL3.8
N$73
  Top 0.8: LED1.A 51.91,159.54 52.86,160.5 52.86,161.45 54.29,162.88 51.91,165.26 LED2.A
N$74
  Bottom 0.8: RC1.1 44.29,161.45 46.67,161.45 49.05,159.07 LED1.K
N$75
  Bottom 0.8: RC2.1 45.72,168.12 46.67,167.16 46.67,166.69 48.1,165.26 49.05,165.26 LED2.K
N$76
  Bottom 0.8: Q1.1 36.67,166.21 37.62,165.26 37.62,163.35 38.57,162.4 38.57,152.4 40.48,150.5 41.43,150.5 42.86,151.92 42.86,152.88 43.81,153.83 43.33,154.31 43.81,154.78 R13.1
N$77  (via drill 0.6)
  Top 0.8: RL3.5 71.91,152.4 67.62,148.11 62.38,148.11 v57.14,142.88 44.29,130.02 44.29,122.4 49.05,117.64 49.05,111.92 59.05,101.92 59.05,88.59 57.62,87.16 57.62,68.59 59.52,66.68 59.52,52.87 63.81,48.59 63.81,48.11 D201.C
  Bottom 0.8: 66.91,35.02 69.05,32.87 71.43,32.87 C205.2 | 66.91,35.02 66.67,35.26 66.19,35.26 R206.2 | 66.91,35.02 69.53,37.64 69.53,42.4 64.29,47.64 D201.C | 31.19,156.45 31.43,156.21 31.43,154.78 30.48,153.83 30.48,153.35 TP16.1 | 31.19,156.45 30.95,156.69 30.95,159.07 31.43,159.54 31.43,161.92 R75.2 | v57.14,142.88 53.33,142.88 52.38,143.83 45.72,143.83 32.38,157.16 31.91,157.16 31.19,156.45
N$78
  Top 0.8: D202.A 53.81,40.49 53.33,40.49 50.95,42.87 50.95,44.3 53.33,46.68 53.33,47.64 D201.A
N$79
  Bottom 0.8: IC5.5 86.67,60.97 85.72,60.97 83.81,59.07 83.81,54.3 85.24,52.87 85.72,52.87 86.67,51.92 90,51.92 95.72,46.21 95.72,37.16 93.81,35.26 90.95,35.26 88.57,32.87 88.57,32.4 C47.2 88.57,31.92 87.62,32.87 86.19,32.87 82.38,29.06 65.72,29.06 59.52,35.26 54.76,35.26 46.32,26.81 38.44,26.81 30.48,34.78 30.48,44.78 23.33,51.92 17.57,51.92 14.76,54.73 14.76,62.87 C46.+
N$80
  Bottom 0.8: R1A.1 4.29,242.4 4.29,243.83 3.33,244.78 3.33,245.74 3.81,246.21 POWER1.A
N$81
  Bottom 0.8: C43.2 86.67,49.07 82.86,52.87 82.86,62.87 85.24,65.26 86.19,65.26 89.53,61.92 89.05,61.45 89.53,60.97 IC5.7
N$82
  Bottom 0.8: R77.2 87.14,27.16 87.14,29.06 88.57,30.49 89.53,30.49 90.48,31.45 90,31.92 90.48,32.4 C47.1
N$83
  Bottom 0.8: 21.43,56.68 20.95,56.68 20,55.73 19.05,55.73 18.1,54.78 TP24.1 | 21.43,56.68 22.38,56.68 | 22.38,56.68 26.19,56.68 R79.2 | 22.38,56.68 22.38,60.02 25.24,62.87 R78.2 | 21.43,56.68 18.1,60.02 18.1,62.87 C46.-
N$84
  Bottom 0.8: R78.1 27.64,62.96 27.64,63.8 22.86,68.59 22.86,95.73 20.48,98.11 HEADPHONE.1
N$85  (via drill 0.6)
  Top 0.8: v29.52,57.64 29.52,68.11 21.43,76.21 21.43,95.26 18.1,98.59 HEADPHONE.2
  Bottom 0.8: v29.52,57.64 28.57,56.68 R79.1
N$86  (via drill 0.6)
  Top 0.8: v58.1,53.83 58.1,57.16 29.52,85.73 29.05,85.26 28.57,85.73 MIC.1
  Bottom 0.8: v58.1,53.83 59.52,53.83 63.81,58.11 C201.2 | R201.2 29.05,79.54 31.91,79.54 32.38,80.02 32.38,82.88 29.52,85.73 29.05,85.26 28.57,85.73 MIC.1
N$87
  Bottom 0.8: R202.2 55.24,54.3 55.72,54.78 56.19,54.78 56.67,55.26 58.1,55.26 62.38,59.54 62.86,59.54 63.81,60.49 C201.1
N$88
  Bottom 0.8: R203.2 35.72,37.64 38.1,40.02 38.1,40.97 36.19,42.87 36.19,43.35 36.67,43.83 37.14,43.83 37.14,44.3 IC201.2 37.14,44.78 35.24,46.68 34.29,46.68 30.95,50.02 30.95,56.83 33.31,59.19 51.78,59.19 54.76,56.21 R202.1
N$89  (via drill 0.6)
  Top 0.8: v108.1,33.83 94.29,33.83 82.38,21.92 48.75,21.92 v42.33,28.34
  Bottom 0.8: IC201.1 34.29,44.78 33.23,43.72 33.23,36.79 34.29,35.73 35.24,35.73 R203.1 35.29,35.38 v42.33,28.34 | v108.1,33.83 109.05,34.78 C204.2
N$90
  Bottom 0.8: C204.1 109.53,36.68 110,36.68 112.38,34.3 113.34,34.3 113.81,33.83 114.29,33.83 R204.2
N$91
  Bottom 0.8: R204.1 114.76,35.73 115.24,35.26 116.67,35.26 117.62,36.21 120,36.21 120.48,36.68 R205.1
N$92
  Top 0.8: P2.S 80,207.64 80,209.54 80.95,210.5 80.95,211.45 81.43,211.93 82.38,211.93 82.38,212.4 P2.A
  Bottom 0.8: R70.2 82.38,218.12 83.33,218.12 84.29,219.07 84.76,219.07 85.72,218.12 85.72,214.78 83.33,212.4 82.38,212.4 P2.A
N$93  (via drill 0.6)
  Top 0.8: v94.29,59.54 89.53,59.54 88.57,60.49 82.38,60.49 65.72,43.83 62.38,43.83 57.62,48.59 57.62,49.54 55.24,51.92 v47.14,51.92
  Bottom 0.8: v94.29,59.54 111.07,42.76 120.12,42.76 124.29,38.59 124.29,37.64 123.81,37.16 123.34,37.16 120.95,34.78 120.48,34.78 R205.2 | v47.14,51.92 43.19,55.87 39.86,52.54 40,52.4 IC201.6
N$94
  Bottom 0.8: C41.2 56.19,200.97 55.72,201.45 55.72,201.93 55.24,202.4 55.24,203.83 49.05,210.02 42.38,210.02 40,207.64 40.48,207.16 40,206.69 VR6.S
N$95
  Bottom 0.8: R73.1 31.91,203.83 32.38,203.35 32.86,203.35 34.29,201.93 34.76,201.93 36.67,203.83 36.19,204.31 36.67,204.78 VR6.A
N$96
  Bottom 0.8: TR7.2 50,199.54 47.62,197.16 45.72,197.16 44.29,198.59 44.29,199.07 43.33,200.02 40.48,200.02 39.05,198.59 39.05,197.64 38.1,196.69 35.24,196.69 30.95,200.97 31.91,201.93 R73.2
N$97
  Bottom 0.8: R69B.2 72.86,198.59 72.86,199.07 74.76,200.97 75.24,200.97 75.72,201.45 R69A.2
N$98